# EAGLE design updi_serial (EAGLE 7.1.0)
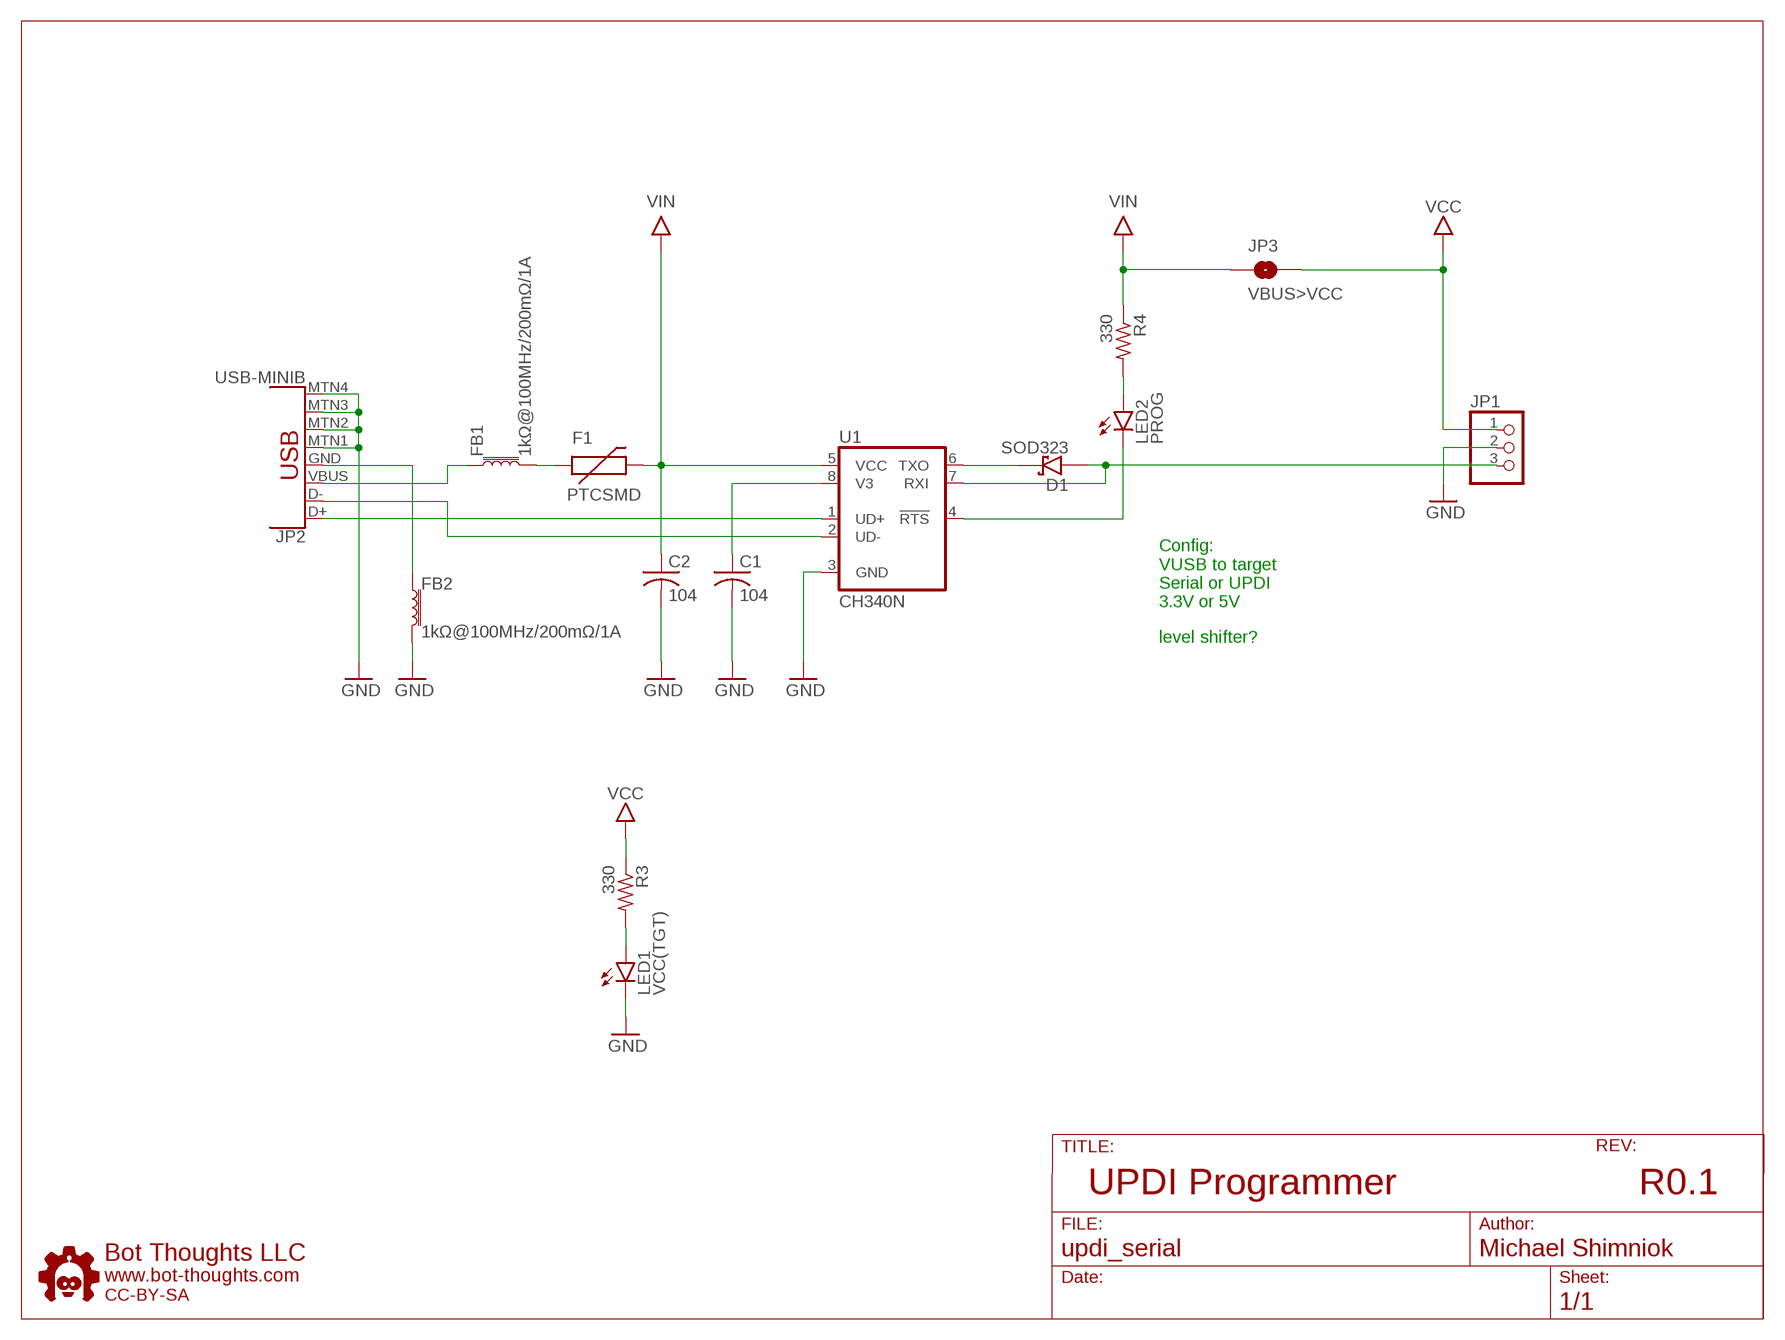
[diagram p0: schematic, sheet 1]

## Parts
C1  104  C-0603  [0603]
C2  104  C-0603  [0603]
D1  SOD323  SCHOTTKY-DIODE-MBR130LSFT1  [SOD123FL]
F1  PTCSMD  [PTC-1206]
FB1  1kΩ@100MHz/200mΩ/1A  FERRITE_BEAD-0603  [0603]
FB2  1kΩ@100MHz/200mΩ/1A  FERRITE_BEAD-0603  [0603]
JP1  PINHD-1X03_2.54-S  [1X03-S]
JP2  USB-MINIB  [USB-MINIB]
JP3  VBUS>VCC  JUMPER-PTH-0.1IN  [JUMPER-PIN-0.1IN]
LED1  VCC(TGT)  LEDCHIPLED_1206  [CHIPLED_1206]
LED2  PROG  LEDCHIPLED_1206  [CHIPLED_1206]
R3  330  R0603  [0603]
R4  330  R0603  [0603]
U1  CH340N  [SOIC8N]
U$5  BTLOGO-LOGO-SM  [BTLOGOS]

## Nets
DM: JP2.D- U1.2(UD-)
DP: JP2.D+ U1.1(UD+)
GND: C1.2(-) C2.2(-) FB2.2 JP1.2 JP2.MTN1(SHIELD1) JP2.MTN2(SHIELD2) JP2.MTN3(SHIELD3) JP2.MTN4(SHIELD4) LED1.C U1.3(GND)
N$1: FB1.1 JP2.VBUS
N$2: F1.1 FB1.2
N$3: D1.C U1.6(TXO)
N$4: LED2.C U1.4(!RTS)
N$5: LED2.A R4.2
N$6: LED1.A R3.2
N$7: FB2.1 JP2.GND
N$8: C1.1(+) U1.8(V3)
UPDI: D1.A JP1.3 U1.7(RXI)
VCC: JP1.1 JP3.2 R3.1
VIN: C2.1(+) F1.2 JP3.1 R4.1 U1.5(VCC)

## Notes on the sheet
- Config:
  VUSB to target
  Serial or UPDI
  3.3V or 5V
- level shifter?
- UPDI Programmer | R0.1

## Library data of the parts
C1 C2 = bt_rcl:C: Capacitor, non-polarized, American symbol
D1 = bt_diode:SCHOTTKY-DIODE: Schottky Diode
F1 = bt:PTC: Resettable Fuse PTC Resettable Fuse. Spark Fun Electronics SKU : COM-08357
FB1 FB2 = SparkFun-Coils:FERRITE_BEAD: Ferrite Bead (blocks, cores, rings, chokes, etc.) Inductor with layers of ferrite used to suppress high frequencies. Often used to isolate high frequency noise. SparkFun Products: IOIO-OTG - V2.2 <https://www.sparkfun.com/products/13613> SparkFun SAMD21 Mini Breakout <https://www.sparkfun.com/products/13664> SparkFun 6 Degrees of Freedom Breakout - LSM6DS3 <https://www.sparkfun.com/products/13339> SparkFun SAMD21 Dev Breakout <https://www.sparkfun.com/products/13672>; PROD_ID: NDUC-07859; VALUE: 30Ω/1.8A
JP1 = pinhead-2:PINHD-1X03: PIN HEADER
JP2 = bt_electromech:USB: USB Connectors USB-MINI-B is fully proven USB-MICRO-B is tested. USB-C is untested.; PROD_ID: CONN-08193
JP3 = bt:JUMPER: Jumper 1-way (open/closed) jumper
LED1 LED2 = bt_opto:LED: LED Various packages
R3 R4 = bt_rcl:R: Resistor, American symbol
U1 = bt_communication:CH340N: CH340N USB to UART Bridge Controller CH340 is a USB converter chip, which converts USB to serial UART interface or to printer interface. In UART mode, CH340 provides common MODEM interface signals, to expand UART interface of computer or upgrade common serial communication devices to USB directly. For more information about converting USB to printer interface, please refer to the datasheet CH340DS2. Datasheet: CH340N.pdf <http://wch-ic.com/products/CH340.html>
U$5 = bt:BTLOGO: Bot Thoughts Logo

## Board
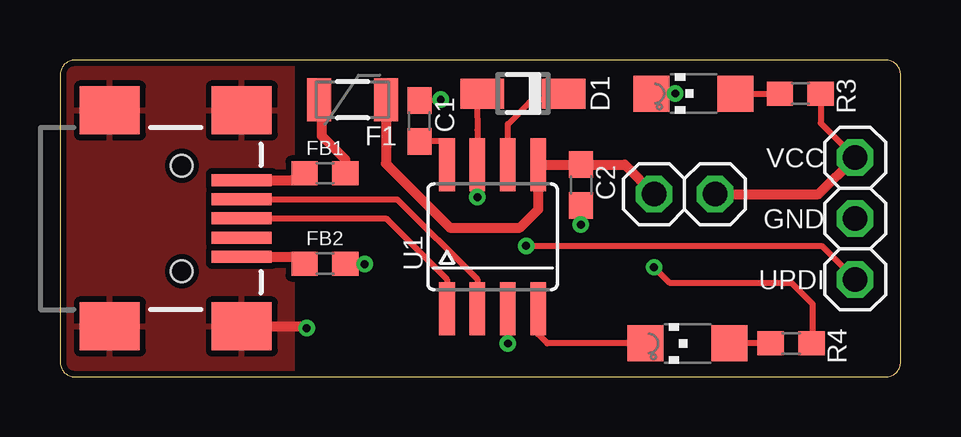
[diagram p1: board, top side]
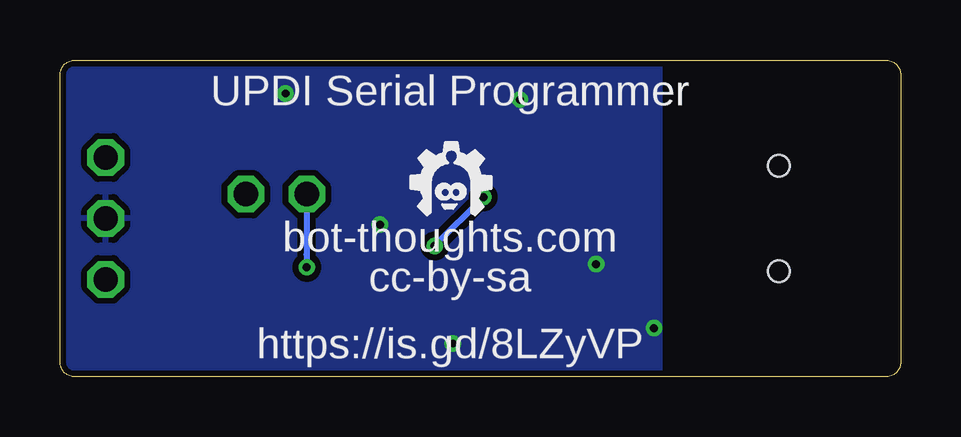
[diagram p2: board, bottom side, seen from below]

Size 35.05 x 13.21 mm. Coordinates in mm from the lower left corner, seen from the top.
Outline: 0,12.57 0,0.64 arc90 0.64,0 34.42,0 arc90 35.05,0.64 35.05,12.57 arc90 34.42,13.21 0.64,13.21 arc90 0,12.57
Copper layers (1*16): Top 0.0356mm / dielectric 1.5011mm / Bottom 0.0356mm
Design rules "LaenPCBOrder": minimum track width 6mil, minimum drill 13mil, track to track 10mil, track to pad 10mil, pad to pad 10mil, via to via 10mil, smd to smd 8mil, copper to edge 10mil, drill to drill 10mil, minimum pad ring 7mil, minimum via ring 7mil, stop-mask expansion 3mil, vias tented up to drill 20mil, thermal gap 10mil

### Footprints (pad centres in the part's own frame; a part is rotated, then mirrored left to right if it is on the bottom)
0603 = smd 1.1 x 1: 1 -0.85,0; 2 0.85,0
SOD123FL = smd 1.8 x 1.25: A 1.7,0; C -1.7,0
PTC-1206 = smd 1 x 1.8: 1 -1.4,0; 2 1.4,0
1X03-S = drill 1.016 octagon: 1 -2.54,0; 2 0,0; 3 2.54,0
USB-MINIB = smd 2.5 x 0.5: D+ 2.5,0; D- 2.5,0.8; GND 2.5,-1.6; ID 2.5,-0.8; VBUS 2.5,1.6 | smd 2.5 x 2: MTN1 -3,4.5; MTN2 2.5,4.5; MTN3 -3,-4.5; MTN4 2.5,-4.5 | hole 0.9: 0,2.2; 0,-2.2
JUMPER-PIN-0.1IN = drill 1.016 octagon: 1 -1.27,0; 2 1.27,0
CHIPLED_1206 = smd 1.5 x 1.5: A -1.75,0; C 1.75,0
SOIC8N = smd 0.66 x 2.2: 1 -1.905,-3; 2 -0.635,-3; 3 0.635,-3; 4 1.905,-3; 5 1.905,3; 6 0.635,3; 7 -0.635,3; 8 -1.905,3

### Placement (x,y rotation side)
C1  14.99,10.67 90 top
C2  21.72,8 270 top
D1  19.3,11.81 180 top
F1  12.19,11.56 0 top
FB1  11.05,8.48 0 top
FB2  11.05,4.72 0 top
JP1  33.15,6.6 270 top
JP2  5.08,6.6 0 top
JP3  26.04,7.62 0 top
LED1  26.42,11.81 180 top
LED2  26.16,1.4 180 top
R3  30.86,11.81 180 top
R4  30.48,1.4 180 top
U1  18.03,5.84 0 top
U$5  18.8,6.6 0 bottom

### Tracks (layer width: path | path; a pad name or v marks a point on that pad's centre or on a via)
DM
  Top 0.254: JP2.D- 14.06,7.4 17.4,4.06 U1.2
DP
  Top 0.254: JP2.D+ 13.59,6.6 16.13,4.06 U1.1
GND  (via drill 0.33)
  Top 0.254: C1.2 v15.88,11.56 | U1.3 v18.67,1.4 | LED1.C v25.65,11.81
  Top 0.406: FB2.2 v12.7,4.7 | C2.2 v21.72,6.35 | JP2.MTN4 10.11,2.1 v10.29,2.03
  pour Bottom: 10.03,0 10.03,13.21 34.42,13.21 arc-90 35.05,12.57 35.05,0.64 arc-90 34.42,0
  pour Top (rank 2): 9.65,0 0.64,0 arc-90 0,0.64 0,12.57 arc-90 0.64,13.21 9.65,13.21
N$1
  Top 0.406: JP2.VBUS 9.69,8.2 FB1.1
N$2
  Top 0.406: FB1.2 11.9,9.06 10.92,10.03 10.92,11.3 F1.1
N$3
  Top 0.254: U1.6 18.67,10.54 19.56,11.43 D1.C
N$4
  Top 0.254: LED2.C 20.32,1.4 19.94,1.78 U1.4
N$5
  Top 0.254: R4.2 LED2.A
N$6
  Top 0.254: LED1.A R3.2
N$7
  Top 0.406: JP2.GND 9.82,5 FB2.1
N$8
  Top 0.254: U1.8 16.13,9.82 C1.1
UPDI  (via drill 0.33)
  Top 0.254: D1.A 17.39,11.31 17.4,10.29 U1.7 v17.4,7.49 | v19.43,5.46 31.75,5.46 JP1.3
  Bottom 0.254: v17.4,7.49 v19.43,5.46
VCC
  Top 0.254: R3.1 31.71,10.58 JP1.1
  Top 0.406: JP3.2 31.62,7.62 JP1.1
VIN  (via drill 0.33)
  Top 0.254: v24.77,4.57 25.4,3.94 30.48,3.94 31.37,3.05 31.37,1.44 R4.1
  Top 0.406: F1.2 13.59,8.89 16.26,6.22 19.18,6.22 19.94,6.99 U1.5 | 19.94,9.27 U1.5 | U1.5 21.71,8.84 C2.1 23.55,8.85 JP3.1
  Bottom 0.254: JP3.1 24.78,5.1 v24.77,4.57

### Text on the board
tNames: VCC | GND | UPDI
bNames: UPDI Serial Programmer | bot-thoughts.com | cc-by-sa | https://is.gd/8LZyVP